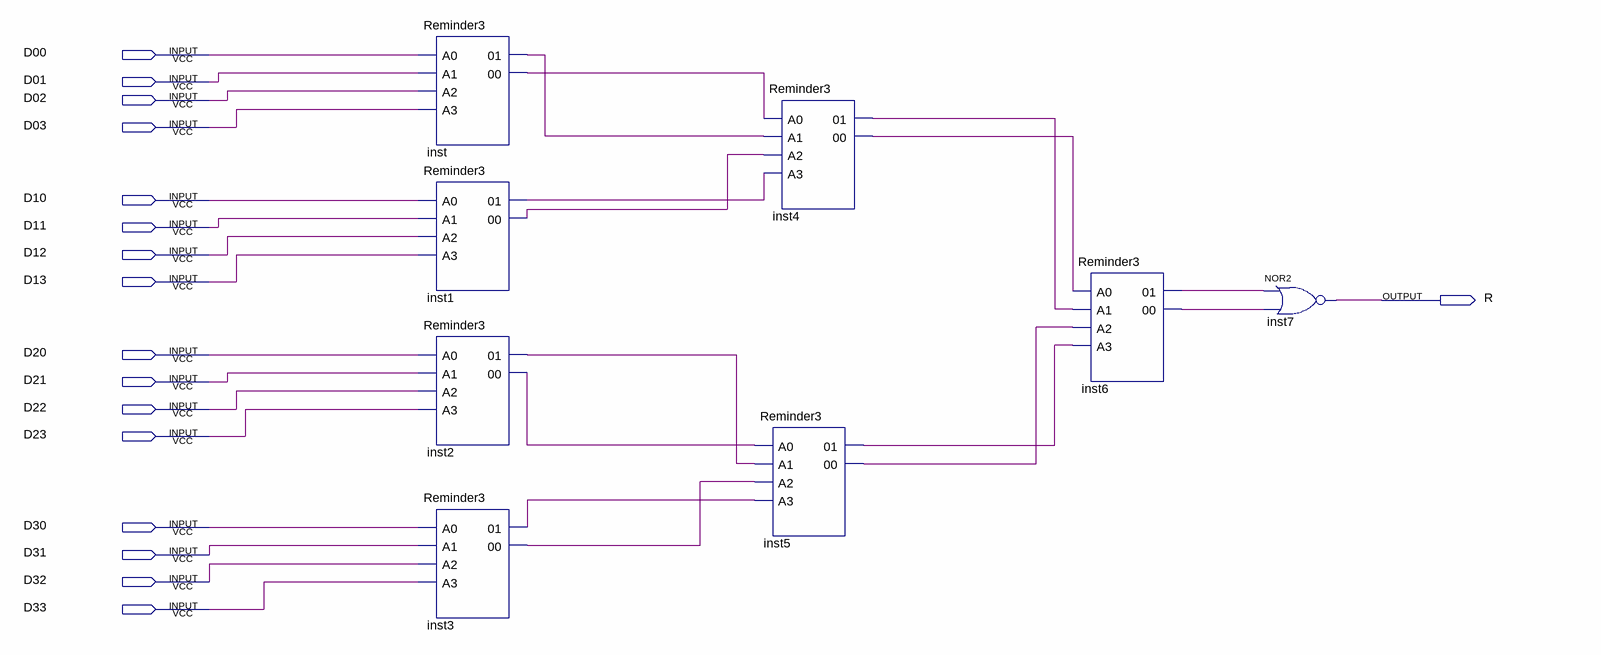
[diagram p0: schematic sheet]
// Quartus schematic Reminder3_4bit.bdf as structural Verilog: 8 symbols, 17 pins
module Reminder3_4bit (
  input  D00,
  input  D01,
  input  D02,
  input  D03,
  input  D10,
  input  D11,
  input  D12,
  input  D13,
  input  D20,
  input  D21,
  input  D22,
  input  D23,
  input  D30,
  input  D31,
  input  D32,
  input  D33,
  output R
);

  wire inst1_00, inst1_01, inst2_00, inst2_01, inst3_00, inst3_01, inst4_00, inst4_01, inst5_00, inst5_01,
       inst6_00, inst6_01, inst_00, inst_01;

  Reminder3 inst (.A0(D00), .A1(D01), .A2(D02), .A3(D03), .\01 (inst_01), .\00 (inst_00));
  Reminder3 inst1 (.A0(D10), .A1(D11), .A2(D12), .A3(D13), .\01 (inst1_01), .\00 (inst1_00));
  Reminder3 inst2 (.A0(D20), .A1(D21), .A2(D22), .A3(D23), .\01 (inst2_01), .\00 (inst2_00));
  Reminder3 inst3 (.A0(D30), .A1(D31), .A2(D32), .A3(D33), .\01 (inst3_01), .\00 (inst3_00));
  Reminder3 inst4 (.A0(inst_00), .A1(inst_01), .A2(inst1_00), .A3(inst1_01), .\01 (inst4_01), .\00 (inst4_00));
  Reminder3 inst5 (.A0(inst2_00), .A1(inst2_01), .A2(inst3_00), .A3(inst3_01), .\01 (inst5_01), .\00 (inst5_00));
  Reminder3 inst6 (.A0(inst4_00), .A1(inst4_01), .A2(inst5_00), .A3(inst5_01), .\01 (inst6_01), .\00 (inst6_00));
  nor inst7 (R, inst6_01, inst6_00);
endmodule
